# EAGLE schematic probe_circuit v28 (EAGLE 9.7.0)
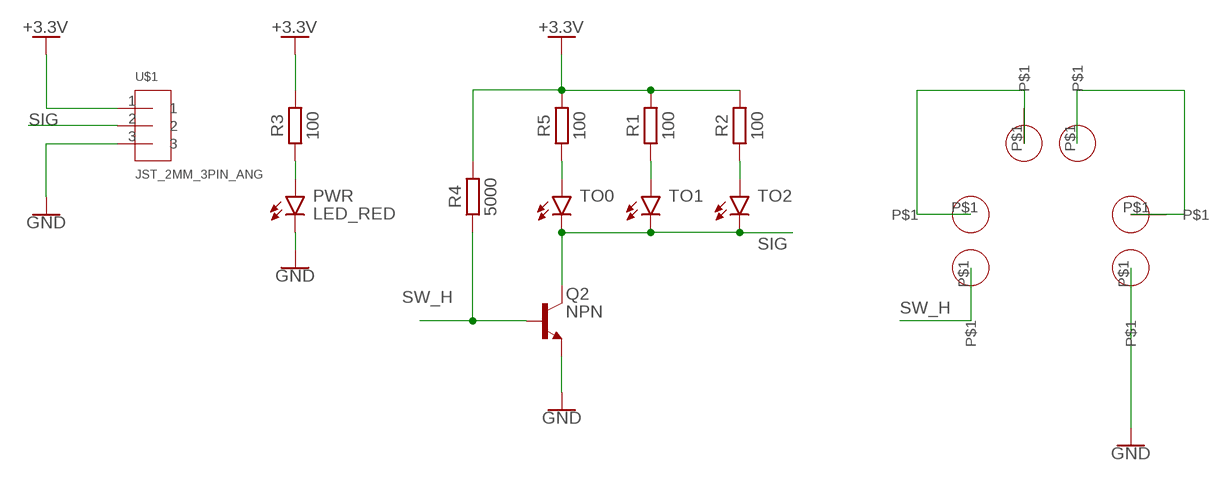
[diagram p0: schematic, sheet 1]

## Parts
F0  4MM_HOLE  [4MM_HOLE]
F1  4MM_HOLE  [4MM_HOLE]
F2  4MM_HOLE  [4MM_HOLE]
F3  4MM_HOLE  [4MM_HOLE]
F4  4MM_HOLE  [4MM_HOLE]
F5  4MM_HOLE  [4MM_HOLE]
PWR  LED_RED  CHIP-FLAT-R_1206  [LEDC3216X75N_FLAT-R]
Q2  NPN  NPN_SOT23  [SOT95P237X112-3N]
R1  100  R_CHIP-0603(1608-METRIC)  [RESC1608X60]
R2  100  R_CHIP-0603(1608-METRIC)  [RESC1608X60]
R3  100  R_CHIP-0603(1608-METRIC)  [RESC1608X60]
R4  5000  R_CHIP-0603(1608-METRIC)  [RESC1608X60]
R5  100  R_CHIP-0603(1608-METRIC)  [RESC1608X60]
TO0  LED_BLUE  CHIP-FLAT-B_1206  [LEDC3216X75N_FLAT-B]
TO1  LED_BLUE  CHIP-FLAT-B_1206  [LEDC3216X75N_FLAT-B]
TO2  LED_BLUE  CHIP-FLAT-B_1206  [LEDC3216X75N_FLAT-B]
U$1  JST_2MM_3PIN_ANG  [JST_2MM_3PIN_ANG]

## Nets
+3.3V: R1.2 R2.2 R3.2 R4.2 R5.2 U$1.1
GND: F5.P$1 PWR.C Q2.2(E) U$1.3
N$1: PWR.A R3.1
N$2: F1.P$1 F2.P$1
N$3: R5.1 TO0.A
N$4: F3.P$1 F4.P$1
N$6: R1.1 TO1.A
N$8: R2.1 TO2.A
SIG: Q2.3(C) TO0.C TO1.C TO2.C U$1.2
SW_H: F0.P$1 Q2.1(B) R4.1

## Library data of the parts
F0 F1-F5 = FRES_ICs:4MM_HOLE
PWR = LED:CHIP-FLAT-R; CATEGORY: LED; COLOR: RED; DESCRIPTION: CHIP LED FLAT; SUB-CATEGORY: CHIP; TYPE: FLAT_TOP
Q2 = f_transistors:NPN: NPN - Generic; CATEGORY: Transistor; SUB-CATEGORY: BJT; TYPE: NPN
R1-R5 = Resistor:R: Resistor Fixed - Generic; CATEGORY: Resistor; SUB-CATEGORY: Fixed
TO0 TO1 TO2 = LED:CHIP-FLAT-B; CATEGORY: LED; COLOR: BLUE; DESCRIPTION: CHIP LED FLAT; SUB-CATEGORY: CHIP; TYPE: FLAT_TOP
U$1 = FRES_ICs:JST_2MM_3PIN_ANG